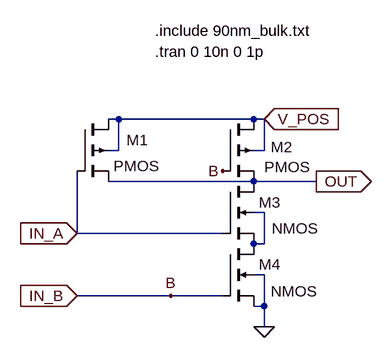
[diagram p0: schematic NAND.asc]
NAND.asc, the LTspice schematic file:
Version 4
SHEET 1 1056 992
WIRE 368 176 352 176
WIRE 576 176 368 176
WIRE 592 176 576 176
WIRE 368 224 368 176
WIRE 368 224 352 224
WIRE 592 224 592 176
WIRE 592 224 576 224
WIRE 576 272 352 272
WIRE 672 272 576 272
WIRE 592 320 576 320
WIRE 304 352 304 256
WIRE 528 352 304 352
WIRE 592 368 592 320
WIRE 592 368 576 368
WIRE 592 416 576 416
WIRE 448 448 304 448
WIRE 528 448 448 448
WIRE 592 464 592 416
WIRE 592 464 576 464
WIRE 592 496 592 464
FLAG 592 496 0
FLAG 448 448 B
FLAG 528 256 B
FLAG 592 176 V_POS
IOPIN 592 176 In
FLAG 304 352 IN_A
IOPIN 304 352 In
FLAG 304 448 IN_B
IOPIN 304 448 In
FLAG 672 272 OUT
IOPIN 672 272 Out
SYMBOL pmos4 304 176 R0
WINDOW 0 76 32 Left 2
SYMATTR InstName M1
SYMATTR Value2 l=90n w=400n
SYMBOL pmos4 528 176 R0
WINDOW 0 74 43 Left 2
WINDOW 3 64 74 Left 2
SYMATTR InstName M2
SYMATTR Value2 l=90n w=400n
SYMBOL nmos4 528 272 R0
WINDOW 3 76 72 Left 2
SYMATTR InstName M3
SYMATTR Value2 l=90n w=200n
SYMBOL nmos4 528 368 R0
WINDOW 3 74 73 Left 2
SYMATTR InstName M4
SYMATTR Value2 l=90n w=200n
TEXT 424 40 Left 2 !.include 90nm_bulk.txt
TEXT 424 72 Left 2 !.tran 0 10n 0 1p

The netlist it stands for:
* NAND.asc
M1 V_POS IN_A OUT V_POS PMOS l=90n w=400n
M2 V_POS IN_B OUT V_POS PMOS l=90n w=400n
M3 OUT IN_A N001 N001 NMOS l=90n w=200n
M4 N001 IN_B 0 0 NMOS l=90n w=200n
.model NMOS NMOS
.model PMOS PMOS
.lib standard.mos
.include 90nm_bulk.txt
.tran 0 10n 0 1p
.backanno
.end